# Altium schematic sheet ui-board.SchDoc
size A4; SheetNumber: 1; SheetTotal: 1
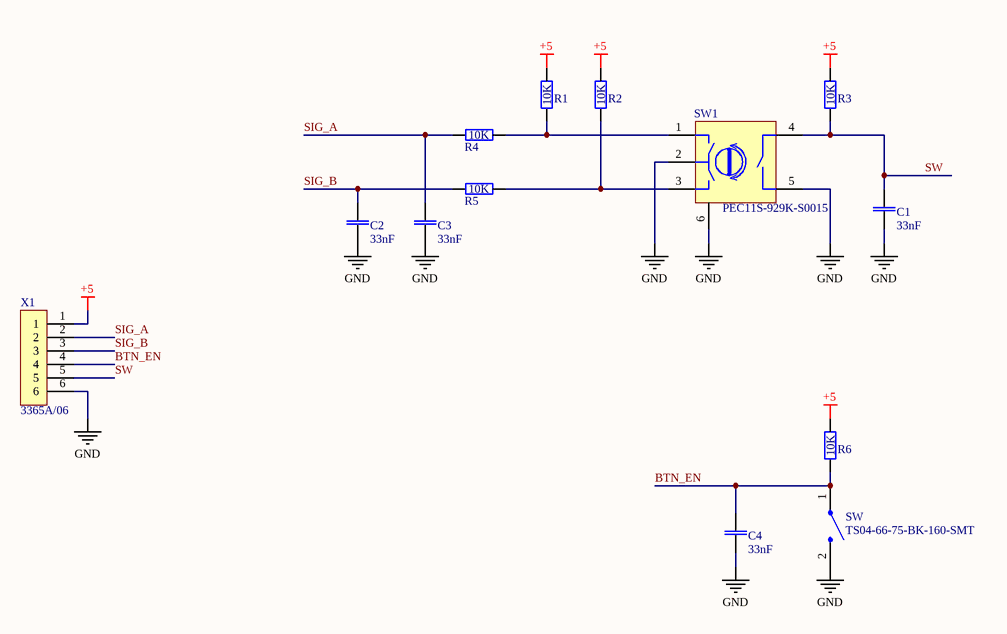
[diagram p0: ui-board.SchDoc]

## Parts
C1  33nF  [CAP0402]
C2  33nF  [CAP0402]
C3  33nF  [CAP0402]
C4  33nF  [CAP0402]
R1  10K  [RES0402]  (value not drawn)
R2  10K  [RES0402]  (value not drawn)
R3  10K  [RES0402]  (value not drawn)
R4  10K  [RES0402]  (value not drawn)
R5  10K  [RES0402]  (value not drawn)
R6  10K  [RES0402]  (value not drawn)
SW  TS04-66-75-BK-160-SMT  [TS04-66-75-BK-160-SMT]
SW1  PEC11S-929K-S0015  [PEC11S-929K-S0015]
X1  3365A/06  [3M_CBL_RIBN_6X]

## Nets
+5: R1.2 R2.2 R3.2 R6.2 X1.1
GND: C1.1 C2.1 C3.1 C4.1 SW.2 SW1.2(C) SW1.5 SW1.6 X1.6
BTN_EN: C4.2 R6.1 SW.1 X1.4
SIG_A: C3.2 R4.1 X1.2
SIG_B: C2.2 R5.1 X1.3
SW: C1.2 R3.1 SW1.4 X1.5
NetR1_1: R1.1 R4.2 SW1.1(A)
NetR2_1: R2.1 R5.2 SW1.3(B)

## Library data of the parts
C1-C4 = C0402C333K4RECTU: MaxVoltage: 16; Value: 33nF; MPN: C0402C333K4RECTU
R1-R6 = RC0402JR-0710KL: Power: 0.063W; Tolerance: 5%; Value: 10K; MPN: RC0402JR-0710KL
X1 = 3365A/06: MPN: 3365A/06